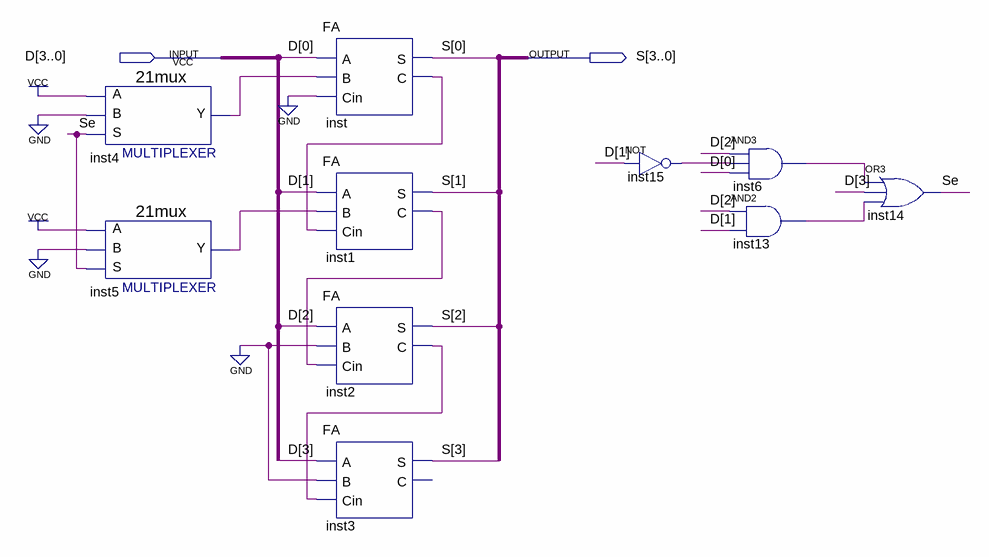
[diagram p0: schematic sheet]
// Quartus schematic Adder4fDD.bdf as structural Verilog: 10 symbols, 2 pins
module Adder4fDD (
  input  [3:0] D,
  output [3:0] S
);

  wire inst1_c, inst2_c, inst4_y, inst5_y, inst6_out, inst13_out, inst15_out, inst_c, Se;

  \21mux  inst4 (.S(Se), .B(1'b0), .A(1'b1), .Y(inst4_y));
  \21mux  inst5 (.S(Se), .B(1'b0), .A(1'b1), .Y(inst5_y));
  FA inst (.A(D[0]), .B(inst4_y), .Cin(1'b0), .S(S[0]), .C(inst_c));
  FA inst1 (.A(D[1]), .B(inst5_y), .Cin(inst_c), .S(S[1]), .C(inst1_c));
  FA inst2 (.A(D[2]), .B(1'b0), .Cin(inst1_c), .S(S[2]), .C(inst2_c));
  FA inst3 (.A(D[3]), .B(1'b0), .Cin(inst2_c), .S(S[3]));  // open: C
  not inst15 (inst15_out, D[1]);
  and inst6 (inst6_out, D[2], inst15_out, D[0]);
  and inst13 (inst13_out, D[2], D[1]);
  or inst14 (Se, inst6_out, D[3], inst13_out);
endmodule
